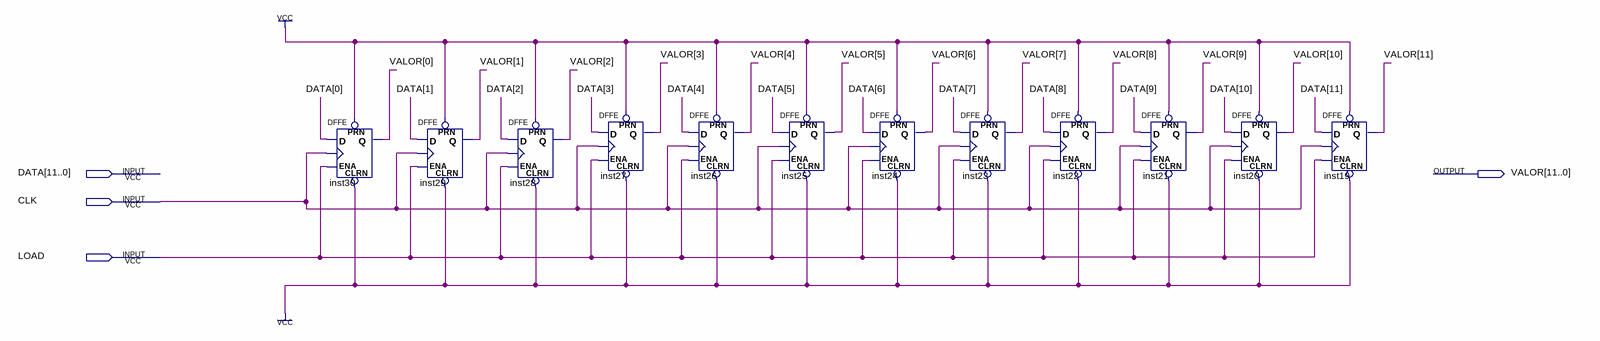
[diagram p0: schematic sheet]
// Quartus schematic Registro_12b.bdf as structural Verilog: 12 symbols, 4 pins
module Registro_12b (
  input  [11:0] DATA,
  input  CLK,
  input  LOAD,
  output [11:0] VALOR
);

  DFFE inst30 (.PRN(1'b1), .CLRN(1'b1), .D(DATA[0]), .CLK(CLK), .ENA(LOAD), .Q(VALOR[0]));
  DFFE inst29 (.PRN(1'b1), .CLRN(1'b1), .D(DATA[1]), .CLK(CLK), .ENA(LOAD), .Q(VALOR[1]));
  DFFE inst28 (.PRN(1'b1), .CLRN(1'b1), .D(DATA[2]), .CLK(CLK), .ENA(LOAD), .Q(VALOR[2]));
  DFFE inst27 (.PRN(1'b1), .CLRN(1'b1), .D(DATA[3]), .CLK(CLK), .ENA(LOAD), .Q(VALOR[3]));
  DFFE inst26 (.PRN(1'b1), .CLRN(1'b1), .D(DATA[4]), .CLK(CLK), .ENA(LOAD), .Q(VALOR[4]));
  DFFE inst25 (.PRN(1'b1), .CLRN(1'b1), .D(DATA[5]), .CLK(CLK), .ENA(LOAD), .Q(VALOR[5]));
  DFFE inst24 (.PRN(1'b1), .CLRN(1'b1), .D(DATA[6]), .CLK(CLK), .ENA(LOAD), .Q(VALOR[6]));
  DFFE inst23 (.PRN(1'b1), .CLRN(1'b1), .D(DATA[7]), .CLK(CLK), .ENA(LOAD), .Q(VALOR[7]));
  DFFE inst22 (.PRN(1'b1), .CLRN(1'b1), .D(DATA[8]), .CLK(CLK), .ENA(LOAD), .Q(VALOR[8]));
  DFFE inst21 (.PRN(1'b1), .CLRN(1'b1), .D(DATA[9]), .CLK(CLK), .ENA(LOAD), .Q(VALOR[9]));
  DFFE inst20 (.PRN(1'b1), .CLRN(1'b1), .D(DATA[10]), .CLK(CLK), .ENA(LOAD), .Q(VALOR[10]));
  DFFE inst19 (.PRN(1'b1), .CLRN(1'b1), .D(DATA[11]), .CLK(CLK), .ENA(LOAD), .Q(VALOR[11]));
endmodule
